# EAGLE design Module4.1 (EAGLE 7.5.0)
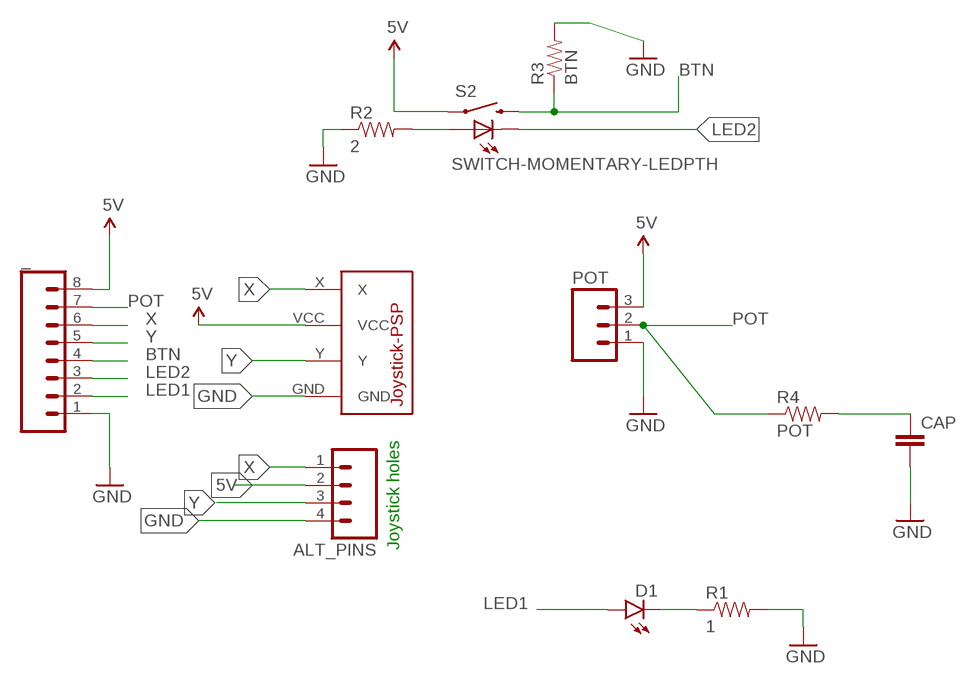
[diagram p0: schematic, sheet 1]

## Parts
_  M08  [1X08_ROUND]
ALT_PINS  M04NO_SILK_ALL_ROUND  [1X04_NO_SILK_ALL_ROUND]
CAP  CAPEZ  [CAP-PTH-SMALLEZ]
D1  LED3MM  [LED3MM]
POT  M031X03_NO_SILK  [1X03_NO_SILK]
R1  1  10KOHM-1/6W-5%(PTH)KIT  [AXIAL-0.3-KIT]
R2  2  10KOHM-1/6W-5%(PTH)KIT  [AXIAL-0.3-KIT]
R3  BTN  10KOHM-1/6W-5%(PTH)KIT  [AXIAL-0.3-KIT]
R4  POT  10KOHM-1/6W-5%(PTH)KIT  [AXIAL-0.3-KIT]
S2  SWITCH-MOMENTARY-LEDPTH  [TACTILE-PTH-LED-12MM]
U$1  JOYSTICK-PSP1000  [JOYSTICK-PSP1000]

## Nets
5V: _.8 ALT_PINS.2 POT.3 S2.4 U$1.VCC
BTN: _.4 R3.P$1 S2.2
GND [GND]: _.1 ALT_PINS.4 CAP.2 POT.1 R1.P$2 R2.P$1 R3.P$2 U$1.GND
LED1: _.2 D1.A
LED2: _.3 S2.C
N$1: D1.K(C) R1.P$1
N$2: R2.P$2 S2.A
N$3: CAP.1 R4.P$2
POT: _.7 POT.2 R4.P$1
X: _.6 ALT_PINS.1 U$1.X
Y: _.5 ALT_PINS.3 U$1.Y

## Notes on the sheet
- Joystick holes

## Library data of the parts
_ = SparkFun-Connectors:M08: Header 8 Standard 8-pin 0.1" header. Use with straight break away headers (SKU : PRT-00116), right angle break away headers (PRT-00553), swiss pins (PRT-00743), machine pins (PRT-00117), and female headers (PRT-00115).; PROD_ID: CONN-08437
ALT_PINS = SparkFun-Connectors:M04: Header 4 Standard 4-pin 0.1" header. Use with straight break away headers (SKU : PRT-00116), right angle break away headers (PRT-00553), swiss pins (PRT-00743), machine pins (PRT-00117), and female headers (PRT-00115). Molex polarized connector foot print use with SKU : PRT-08231 with associated crimp pins and housings. 1MM SMD Version SKU: PRT-10208; PROD_ID: CONN-09696
CAP = SparkFun-Capacitors:CAP: Capacitor Standard 0603 ceramic capacitor, and 0.1" leaded capacitor.
D1 = SparkFun-LED:LED: LEDs Standard schematic elements and footprints for 5mm, 3mm, 1206, and 0603 sized LEDs. 5mm - Spark Fun Electronics SKU : COM-00529 (and others); PROD_ID: DIO-08794
POT = SparkFun-Connectors:M03: Header 3 Standard 3-pin 0.1" header. Use with straight break away headers (SKU : PRT-00116), right angle break away headers (PRT-00553), swiss pins (PRT-00743), machine pins (PRT-00117), and female headers (PRT-00115). Molex polarized connector foot print use with SKU : PRT-08232 with associated crimp pins and housings.
R1-R4 = SparkFun-Resistors:10KOHM-1/6W-5%(PTH): RES-08375; PROD_ID: RES-08375
S2 = Local Library:SWITCH-MOMENTARY-LED
U$1 = SparkFun-Electromechanical:JOYSTICK-PSP1000: This is a footprint for the PSP-1000 Joystick. 4-pins: X, Y, Vcc and GND

## Net classes
0 default: width 0.635 mm, drill 0.254 mm, clearance 0.381 mm
1 5V: width 0.635 mm, drill 0.254 mm, clearance 0.381 mm

## Board
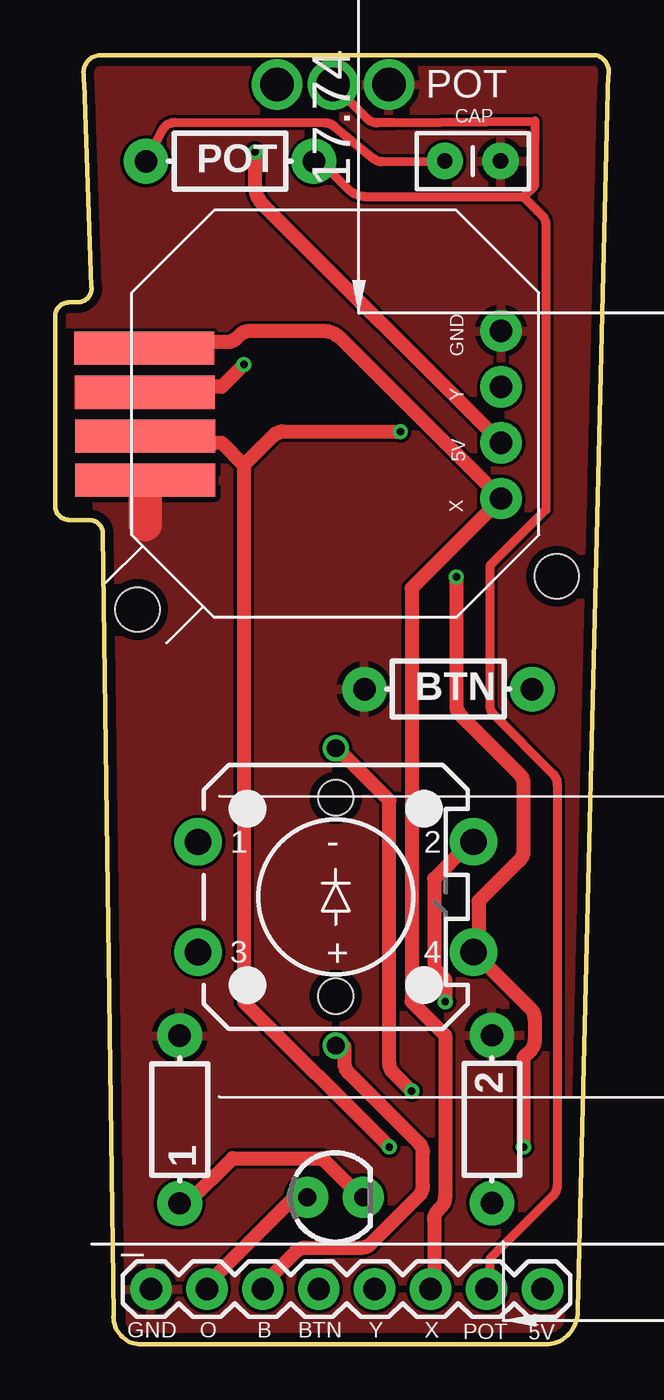
[diagram p1: board, top side]
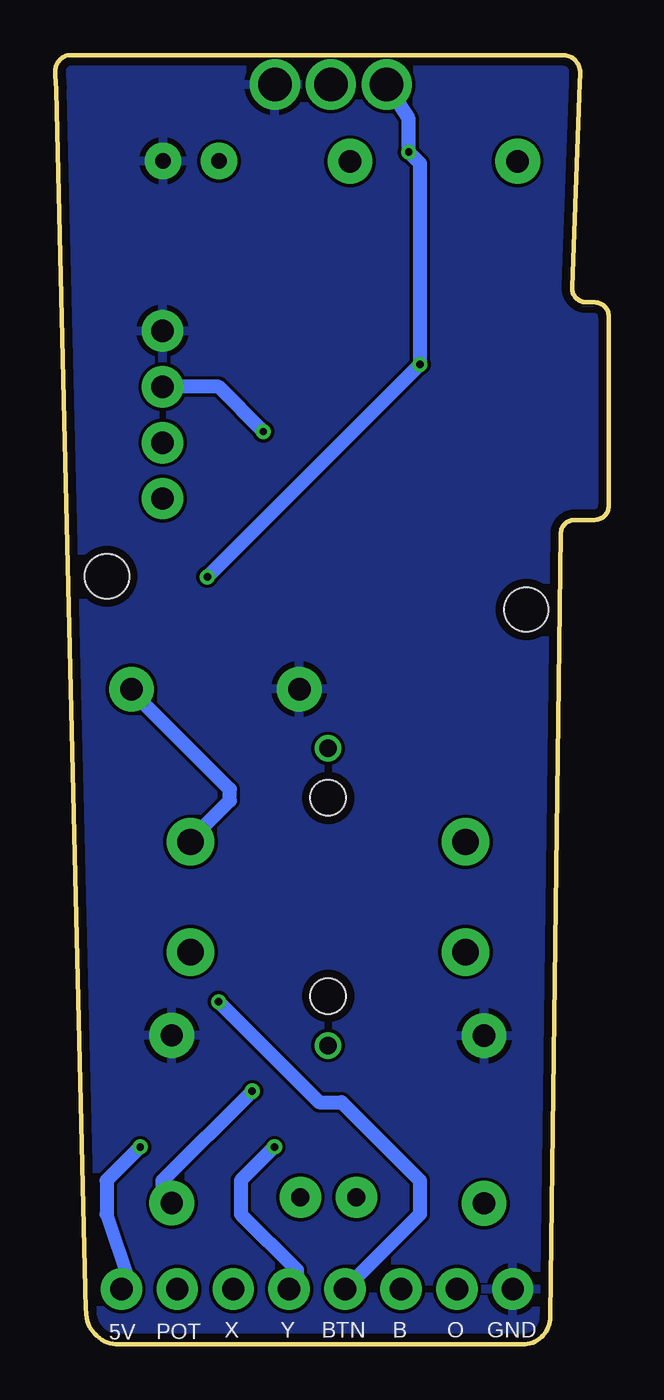
[diagram p2: board, bottom side, seen from below]

Size 25.15 x 58.59 mm. Coordinates in mm from the lower left corner, seen from the top.
Outline: 2.66,1.32 2.66,1.26 arc90 3.91,0 22.26,0 arc90 23.74,1.48
Outline: 1.66,48.02 arc-92 1.03,47.36 0.63,47.36 arc90 0,46.72 0,38.11 arc90 0.63,37.47 1.55,37.47 arc-89 2.18,36.84 2.66,1.29
Outline: 1.31,57.39 1.3,57.66 arc-91 1.97,58.58 24.52,58.59 arc-93 25.13,57.66 25.1,57.04
Outline: 23.75,1.57 25.1,56.99
Outline: 1.65,48.05 1.32,57.34
Copper layers (1*16): Top 0.0356mm / dielectric 1.5011mm / Bottom 0.0356mm
Design rules "LaenPCBOrder": minimum track width 6mil, minimum drill 13mil, track to track 6mil, track to pad 6mil, pad to pad 6mil, via to via 6mil, smd to smd 6mil, copper to edge 15mil, drill to drill 6mil, minimum pad ring 7mil, minimum via ring 7mil, stop-mask expansion 3mil, vias tented up to drill 0mil, thermal gap 10mil

### Footprints (pad centres in the part's own frame; a part is rotated, then mirrored left to right if it is on the bottom)
1X08_ROUND = drill 1.016 pad 1.88: 1 0,0; 2 2.54,0; 3 5.08,0; 4 7.62,0; 5 10.16,0; 6 12.7,0; 7 15.24,0; 8 17.78,0
1X04_NO_SILK_ALL_ROUND = drill 1.016 pad 1.88: 1 0,0; 2 2.54,0; 3 5.08,0; 4 7.62,0
CAP-PTH-SMALLEZ = drill 0.7 pad 1.651: 1 0,0; 2 2.54,0
LED3MM = drill 0.813 pad 1.88: A -1.27,0; K 1.27,0
1X03_NO_SILK = drill 1.524 pad 2.184: 1 0,0; 2 2.54,0; 3 5.08,0
AXIAL-0.3-KIT = drill 1.016 pad 2.032: P$1 -3.81,0; P$2 3.81,0
TACTILE-PTH-LED-12MM = drill 1.2 pad 2.159: 1 -6.25,2.5; 2 6.25,2.5; 3 -6.25,-2.5; 4 6.25,-2.5 | drill 0.8: A 0,6.75; C 0,-6.75 | hole 1.6: 0,4.5; 0,-4.5
JOYSTICK-PSP1000 = smd 1.5 x 6.35: GND -3,8.639; GND1 -3,8.639; VCC 0.981,8.658; X 3,8.677; Y -1,8.639 | hole 2: -8.89,8.985; -7.375,-10.06

### Placement (x,y rotation side)
_  4.36,2.52 0 top
ALT_PINS  20.26,38.44 90 top
CAP  17.7,53.77 0 top
D1  12.73,6.69 0 top
POT  15.16,57.25 180 top
R1  5.66,10.22 90 top
R2  19.85,10.24 270 top
R3  17.86,29.78 180 top
R4  7.95,53.76 180 top
S2  12.75,20.34 0 top
U$1  12.73,42.28 90 top

### Tracks (layer width: path | path; a pad name or v marks a point on that pad's centre or on a via)
5V  (via drill 0.33)
  Top 0.635: v21.28,8.97 21.28,13.04 21.6,13.36 arc45 21.79,13.81 21.79,14.81 arc45 21.6,15.25 19.25,17.61 S2.4 19.25,18.12 19.25,20.15 21.09,21.99 arc45 21.28,22.44 21.28,25.47 arc45 21.09,25.92 18.42,28.6 arc-45 18.23,29.05 v18.23,34.88 | ALT_PINS.2 9.46,51.78 arc-45 9.09,52.68 v9.09,54.18 | v8.58,44.53 7.56,43.52 5.02,43.52 U$1.VCC
  Bottom 0.61: 21.79,2.88 22.8,5.92
  Bottom 0.635: 22.8,5.92 22.8,7.45 v21.28,8.97 | 21.79,2.88 _.8 | v18.23,34.88 v8.58,44.53 8.58,53.68 v9.09,54.18 9.09,55.69 POT.3
BTN  (via drill 0.33)
  Top 0.635: v17.72,15.58 17.72,16.59 17.21,17.1 17.21,21.16 18.74,22.69 S2.2
  Bottom 0.635: v17.72,15.58 13.15,11 12.13,11 8.58,7.45 8.58,5.92 11.63,2.88 _.4 | R3.P$1 21.28,29.29 17.21,25.23 17.21,24.72 18.74,23.2 S2.2
GND
  Top 1.524: U$1.GND 4.09,37.27
  pour Top: 1.94,59.37 25.25,59.31 22.93,0.72 3.44,0.72 1.84,36.97 -0.3,37.3 -0.3,47.41 1.62,47.77
  pour Bottom: 1.99,59.3 23.85,59.28 arc-91 25.43,58.46 23.62,0.76 arc-89 22.98,0.14 2.96,0.14 2.09,36.66 arc74 1.6,37.25 0.52,37.52 arc-76 0.04,38.14 0.04,46.72 arc-78 0.54,47.34 1.54,47.54 1.12,58.64 arc-93 1.76,59.3
LED1
  Top 0.635: _.2 7.05,2.88 11.12,6.94 D1.A
LED2
  Top 0.635: S2.C 13.15,13.54 13.15,12.79 arc45 13.34,12.34 16.52,9.16 arc-45 16.71,8.71 16.71,7.2 arc-45 16.52,6.75 14.35,4.59 arc-45 13.9,4.4 11.38,4.4 arc45 10.93,4.21 9.59,2.88 _.3
N$1
  Top 0.635: D1.K 13.66,6.94 12.13,8.46 8.07,8.46 6.04,6.43 R1.P$1
N$2  (via drill 0.33)
  Top 0.635: v16.2,11.51 15.37,12.34 arc-45 15.18,12.79 15.18,24.72 13.15,26.75 S2.A
  Bottom 0.635: v16.2,11.51 20.26,7.45 20.26,6.43 R2.P$2
N$3
  Top 0.406: CAP.1 14.87,53.75 arc-40 14.46,53.89 12.67,55.37 arc39 12.27,55.51 5.45,55.53 arc62 4.88,55.19 R4.P$2
POT
  Top 0.406: 21.28,52.15 21.79,52.66 21.79,54.69 21.79,55.6 15.38,55.52 14.63,55.51 arc-45 14.19,55.69 POT.2 | 21.28,52.15 14.18,52.15 arc-45 13.29,52.52 12.13,53.68 R4.P$1 | 21.28,52.15 22.11,51.32 arc-45 22.29,50.87 22.29,37.93 19.75,35.39 19.75,29.05 arc45 19.94,28.6 22.62,25.92 arc-45 22.8,25.47 22.8,7.2 arc-45 22.62,6.75 19.75,3.89 19.75,2.88 _.7
X
  Top 0.635: _.6 17.21,2.88 17.21,5.66 arc-45 17.4,6.11 17.54,6.25 arc45 17.72,6.7 17.72,14.05 16.2,15.58 16.2,34.37 ALT_PINS.1 13.01,45.68 arc45 12.12,46.06 8.84,46.06 arc45 8.39,45.87 8.26,45.73 arc-45 7.81,45.55 5.02,45.55 U$1.X
Y  (via drill 0.33)
  Top 0.635: v15.18,8.97 8.58,15.58 8.58,39.96 | 8.58,39.96 7.56,40.98 5.02,40.98 U$1.Y | 8.58,39.96 9.92,41.3 arc-45 10.36,41.48 v15.69,41.48
  Bottom 0.635: v15.18,8.97 16.71,7.45 16.71,5.92 14.17,3.38 14.17,2.88 _.5 | ALT_PINS.3 17.72,43.52 v15.69,41.48

### Text on the board
tPlace: GND | Y | 5V | X
tNames: GND | O | B | BTN | Y | X | POT | 5V
bNames: GND | O | B | BTN | Y | X | POT | 5V